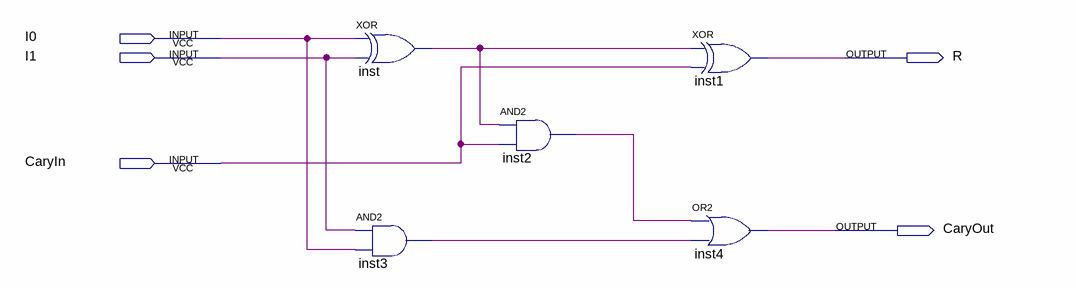
[diagram p0: schematic sheet]
// Quartus schematic FAdder1Bit.bdf as structural Verilog: 5 symbols, 5 pins
module FAdder1Bit (
  input  I0,
  input  I1,
  input  CaryIn,
  output R,
  output CaryOut
);

  wire inst2_out, inst3_out, inst_out;

  xor inst (inst_out, I0, I1);
  and inst3 (inst3_out, I1, I0);
  and inst2 (inst2_out, inst_out, CaryIn);
  xor inst1 (R, inst_out, CaryIn);
  or inst4 (CaryOut, inst2_out, inst3_out);
endmodule
